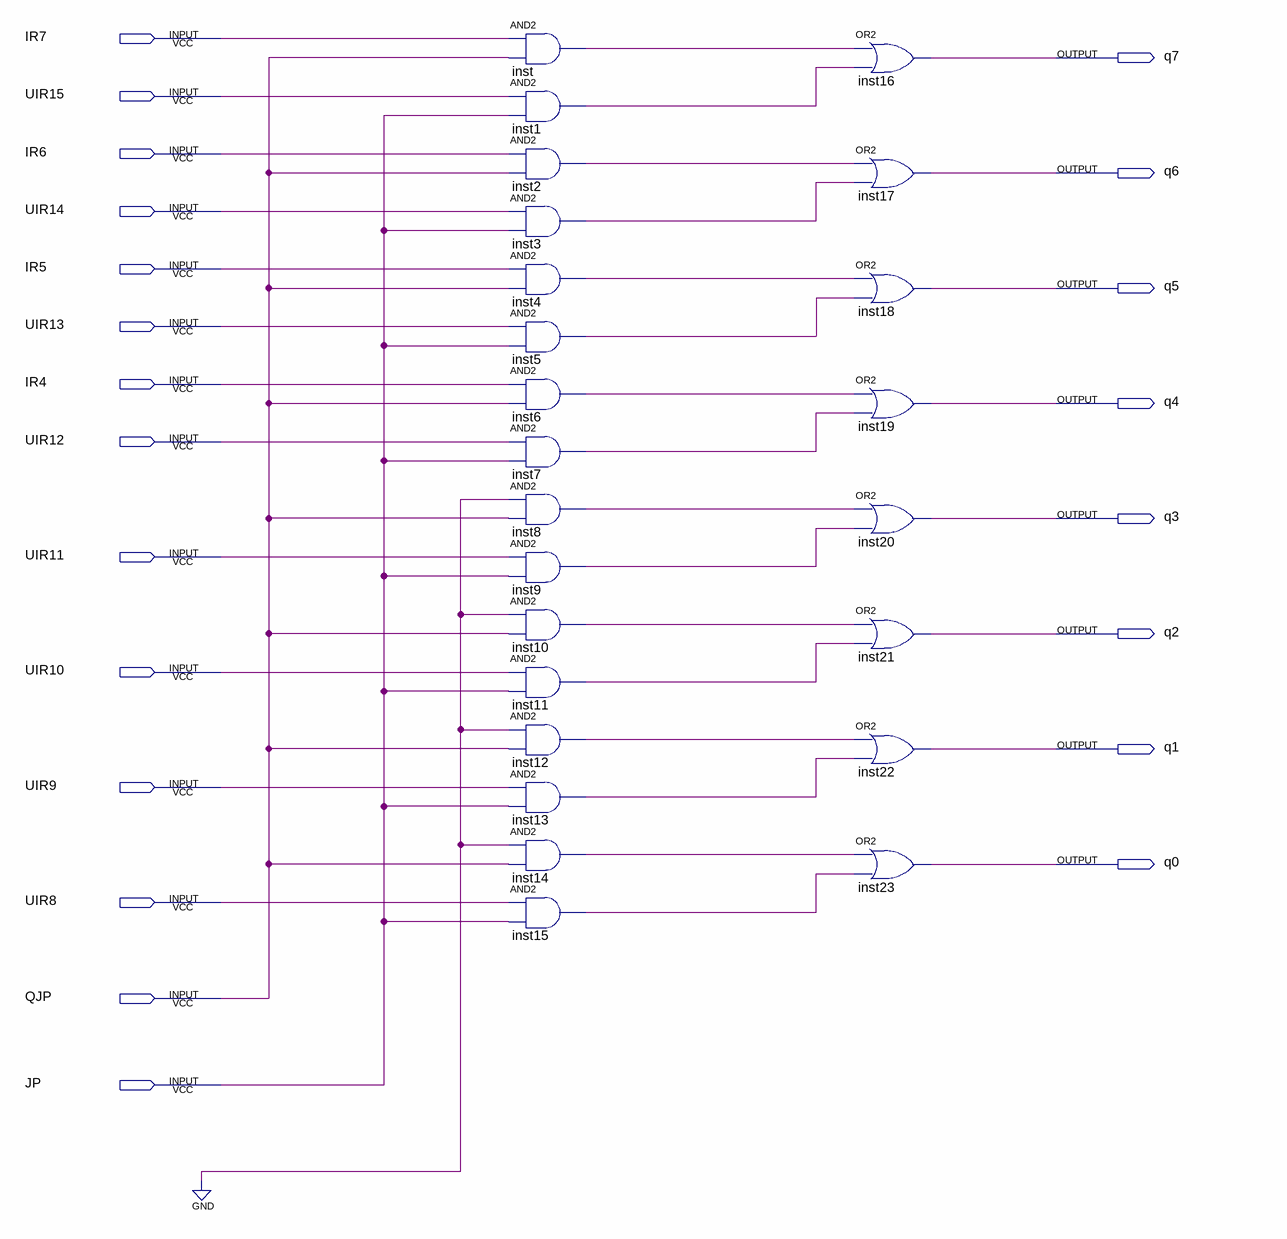
[diagram p0: schematic sheet]
// Quartus schematic houjidizhixingchengdianlu.bdf as structural Verilog: 24 symbols, 22 pins
module houjidizhixingchengdianlu (
  input  IR7,
  input  UIR15,
  input  IR6,
  input  UIR14,
  input  IR5,
  input  UIR13,
  input  IR4,
  input  UIR12,
  input  UIR11,
  input  UIR10,
  input  UIR9,
  input  UIR8,
  input  QJP,
  input  JP,
  output q7,
  output q6,
  output q5,
  output q4,
  output q3,
  output q2,
  output q1,
  output q0
);

  wire inst1_out, inst2_out, inst3_out, inst4_out, inst5_out, inst6_out, inst7_out, inst8_out, inst9_out,
       inst10_out, inst11_out, inst12_out, inst13_out, inst14_out, inst15_out, inst_out;

  and inst (inst_out, IR7, QJP);
  and inst1 (inst1_out, UIR15, JP);
  and inst2 (inst2_out, IR6, QJP);
  and inst3 (inst3_out, UIR14, JP);
  and inst4 (inst4_out, IR5, QJP);
  and inst5 (inst5_out, UIR13, JP);
  and inst6 (inst6_out, IR4, QJP);
  and inst7 (inst7_out, UIR12, JP);
  and inst8 (inst8_out, 1'b0, QJP);
  and inst9 (inst9_out, UIR11, JP);
  and inst10 (inst10_out, 1'b0, QJP);
  and inst11 (inst11_out, UIR10, JP);
  and inst12 (inst12_out, 1'b0, QJP);
  and inst13 (inst13_out, UIR9, JP);
  and inst14 (inst14_out, 1'b0, QJP);
  and inst15 (inst15_out, UIR8, JP);
  or inst16 (q7, inst_out, inst1_out);
  or inst17 (q6, inst2_out, inst3_out);
  or inst18 (q5, inst4_out, inst5_out);
  or inst19 (q4, inst6_out, inst7_out);
  or inst20 (q3, inst8_out, inst9_out);
  or inst21 (q2, inst10_out, inst11_out);
  or inst22 (q1, inst12_out, inst13_out);
  or inst23 (q0, inst14_out, inst15_out);
endmodule
